# EAGLE design test-board-64 (EAGLE 8.3.2)
DESIGNER: JON NEWMAN, MWL@MIT; DESIGN_NAME: 64 Channel Headstage Test Board; LICENSE: (c) Jon Newman CERN OHL v1.2; REVISION: 1.3
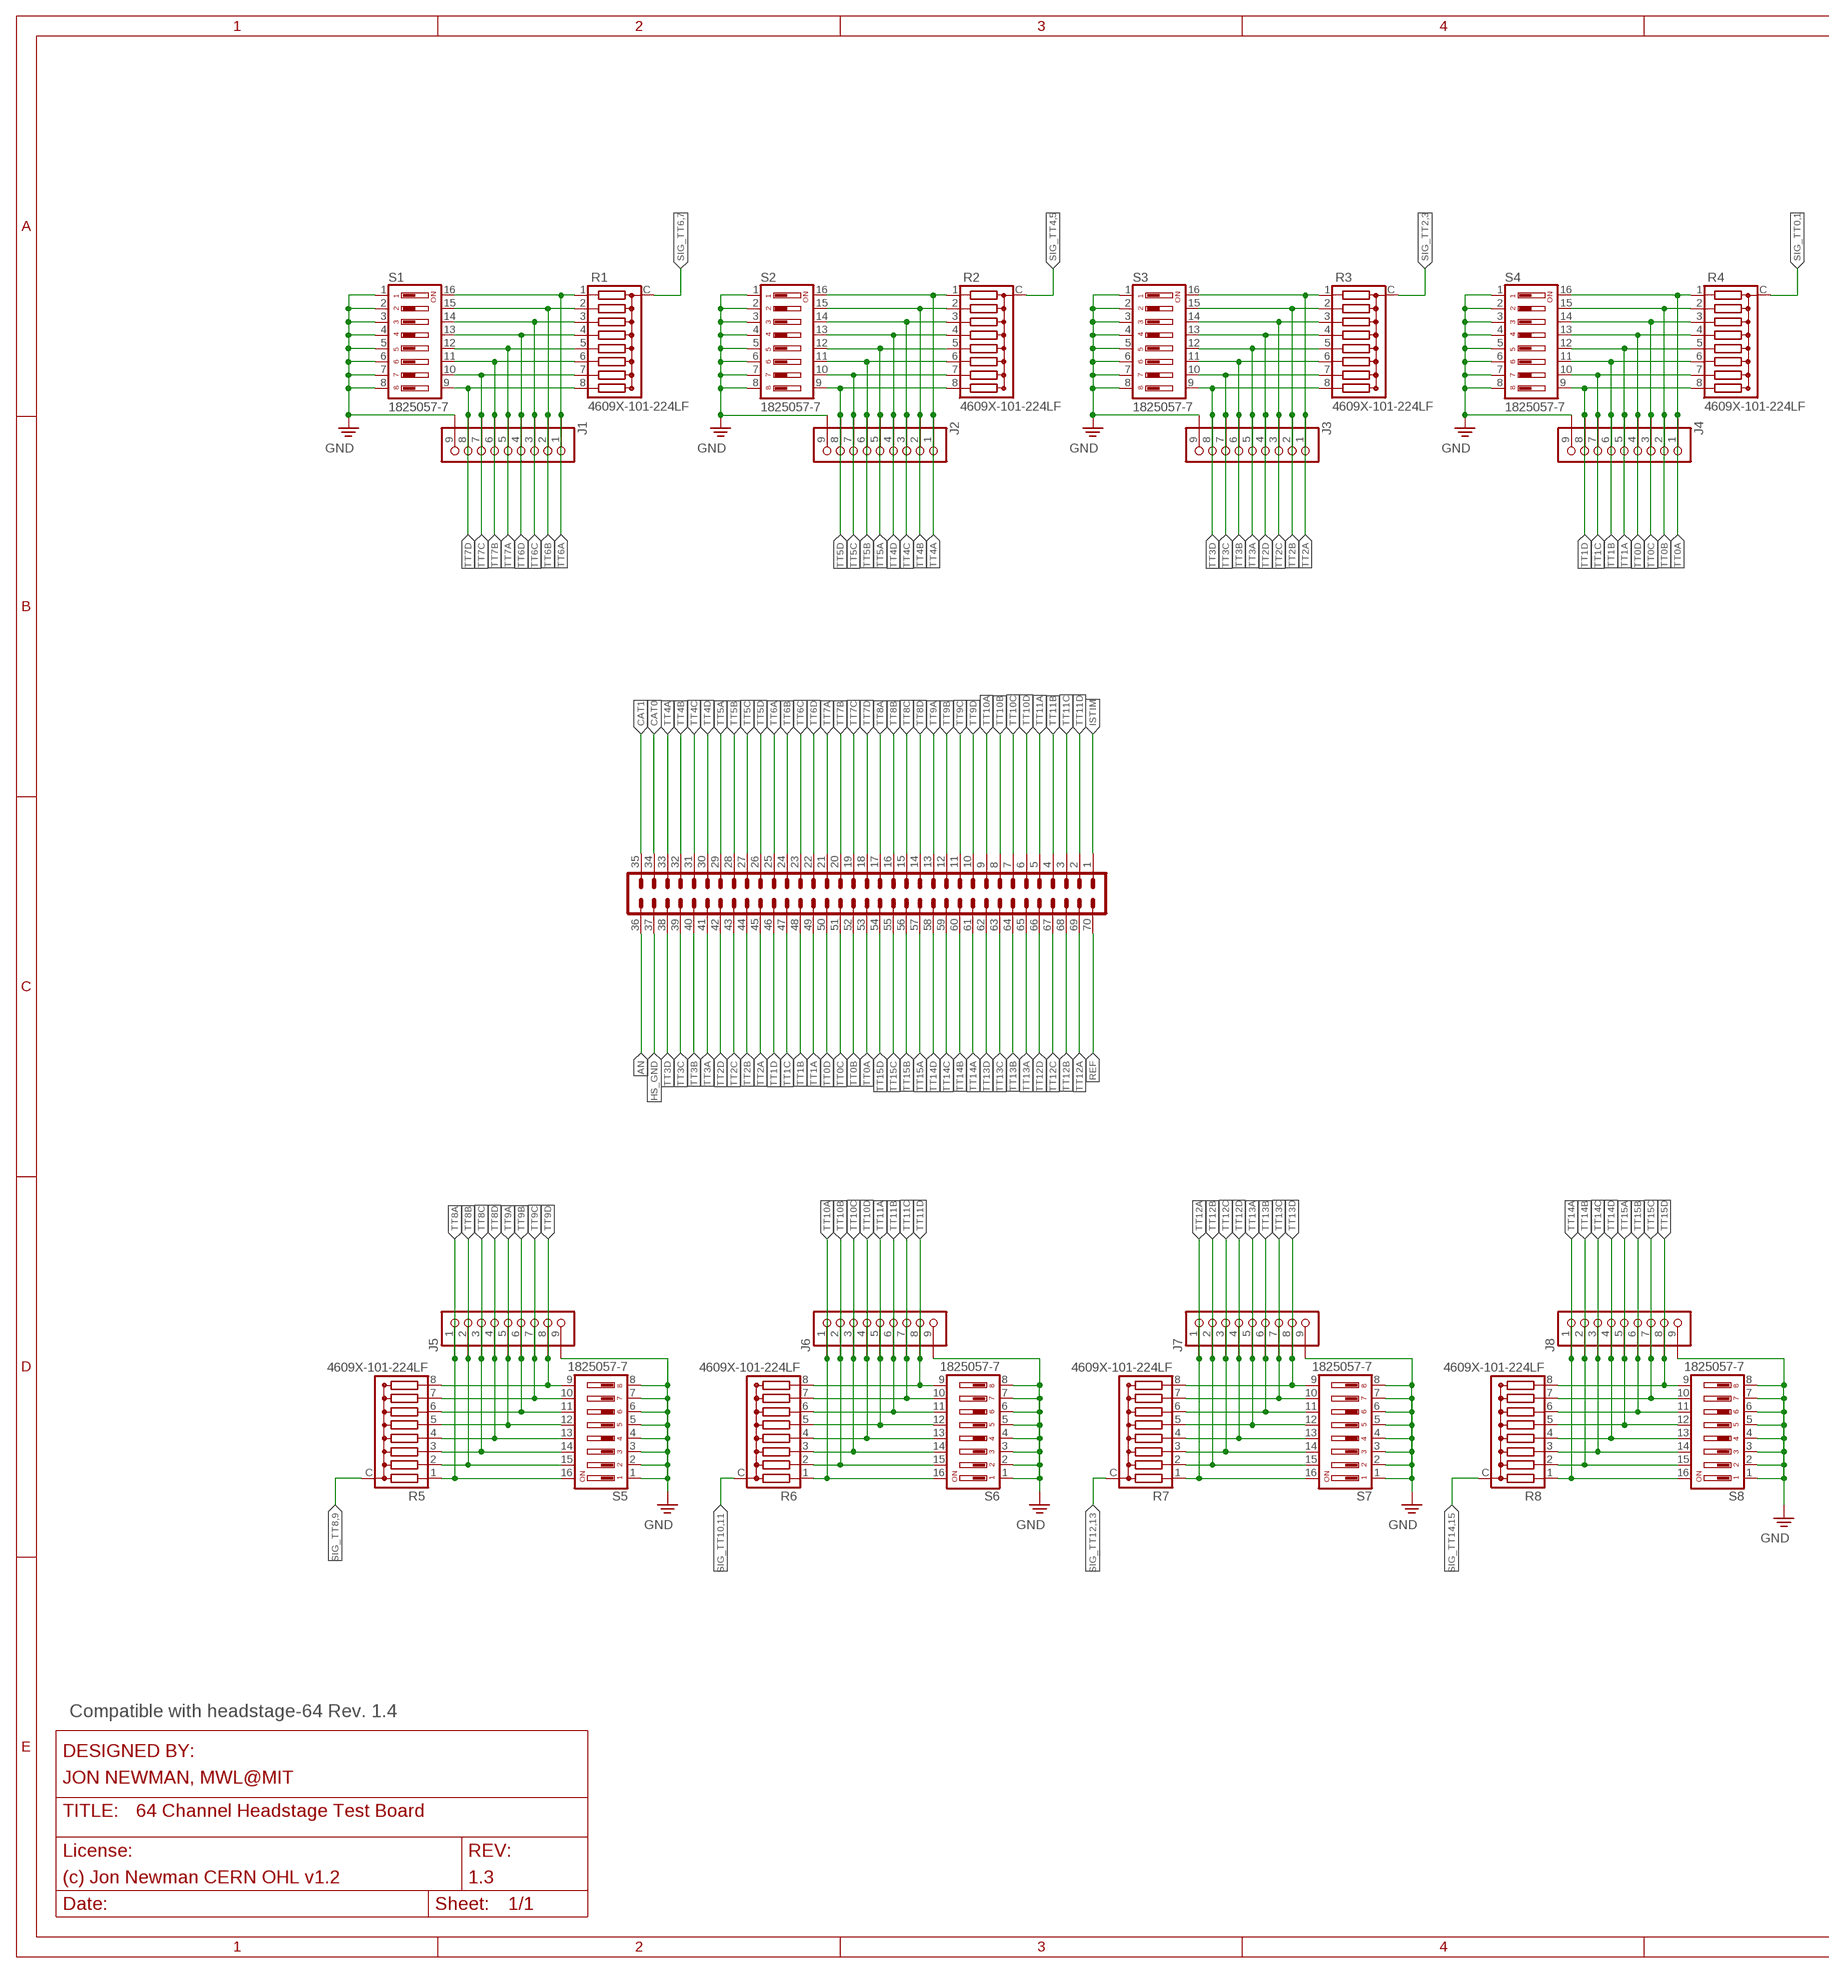
[diagram p0: schematic, sheet 1, part 1 of 2]
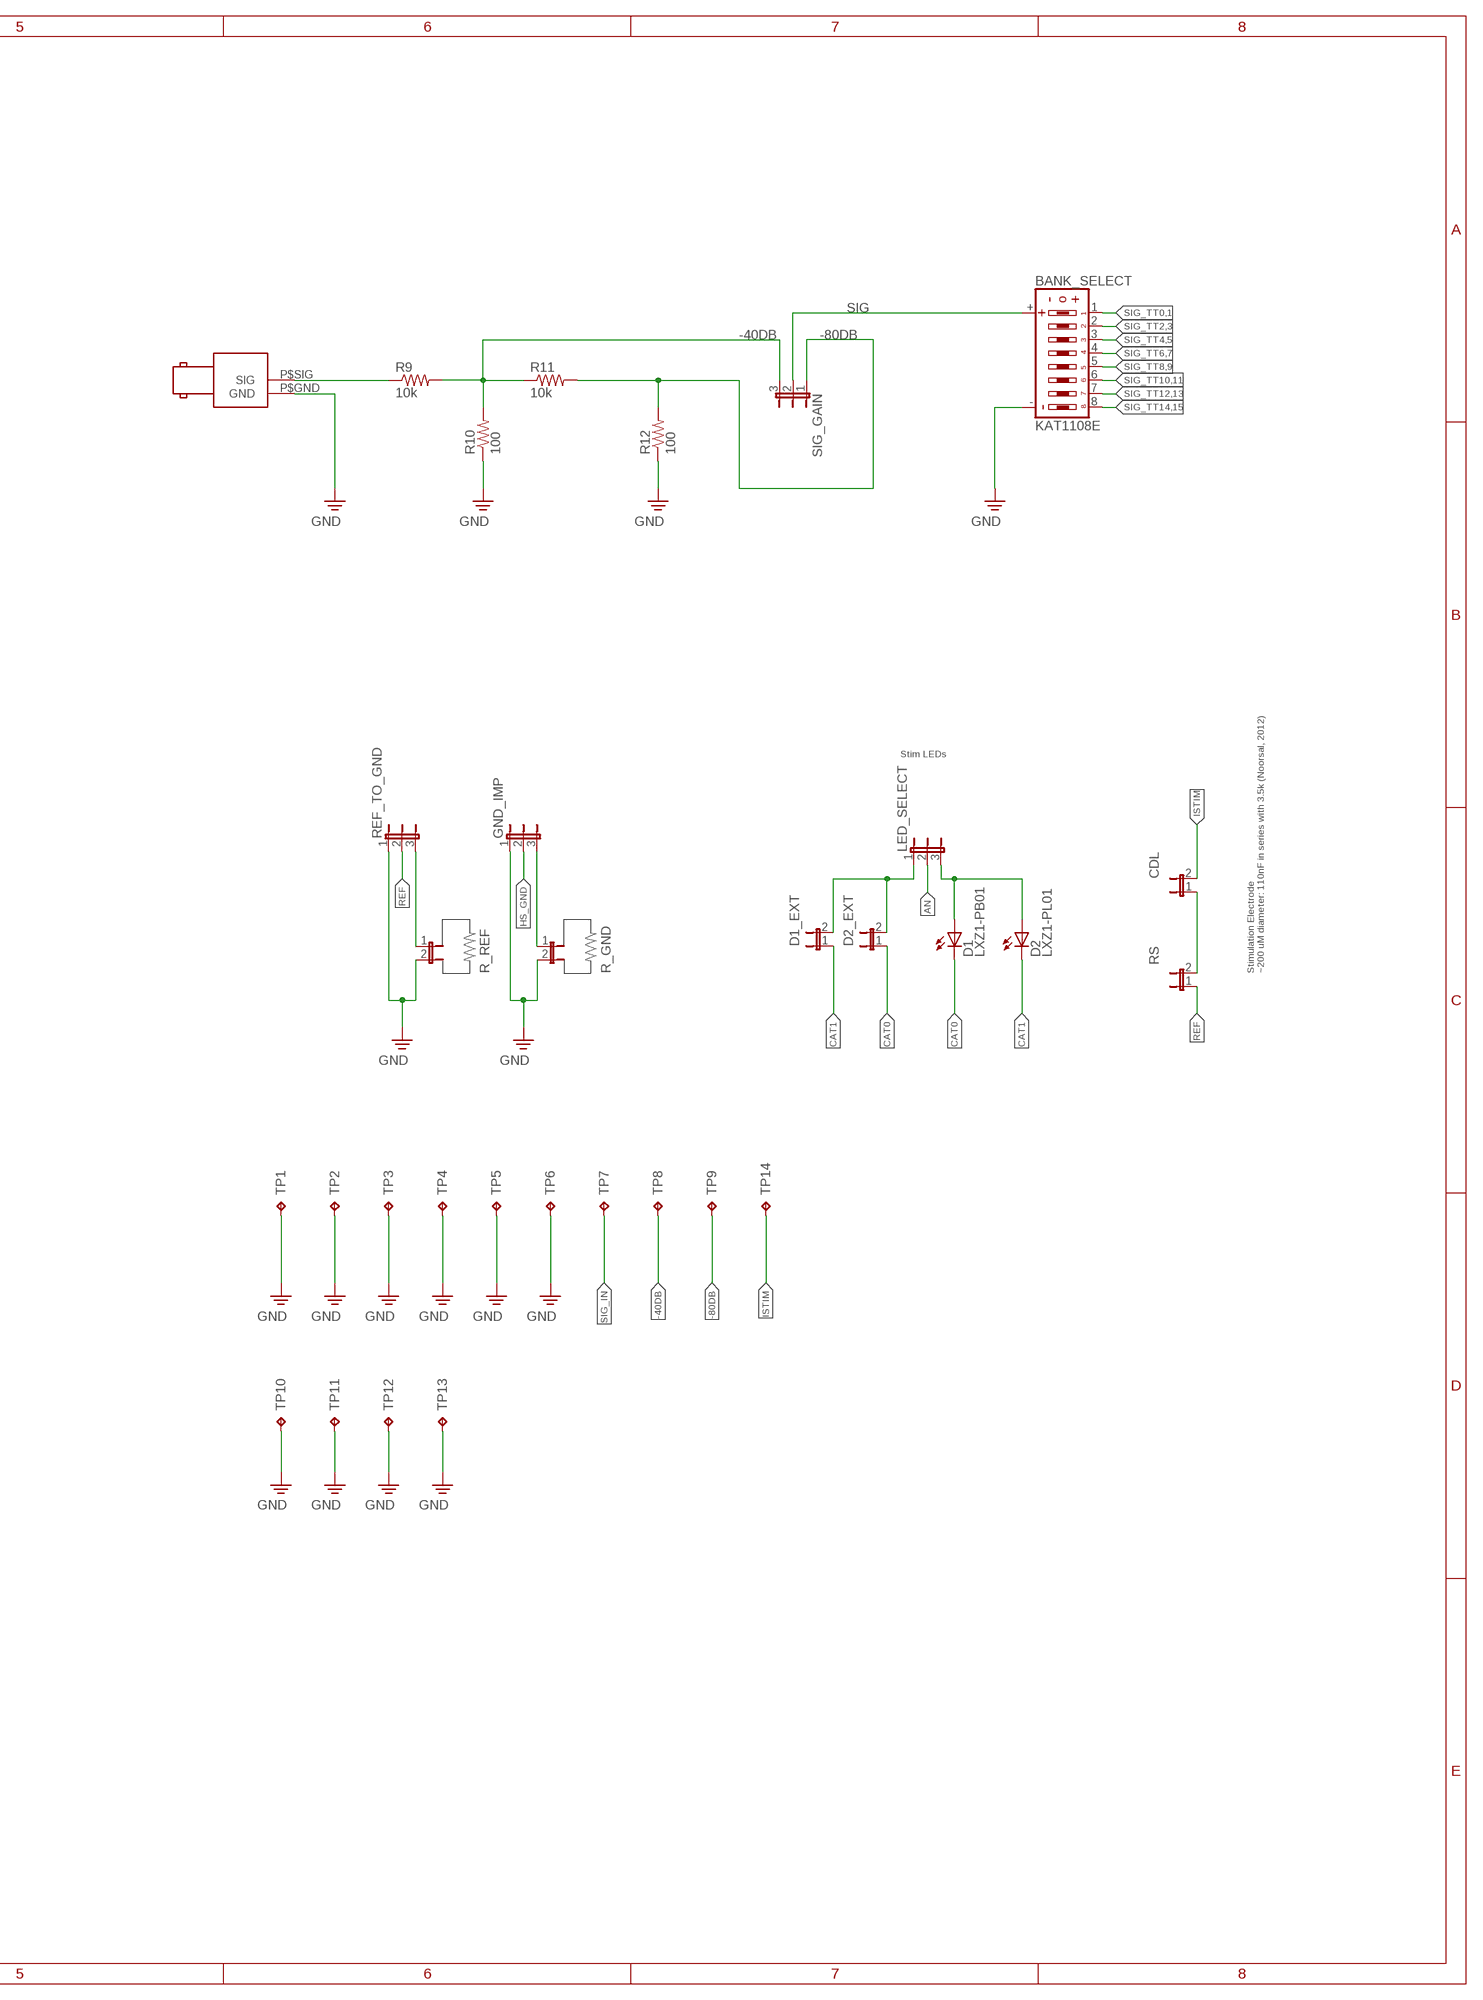
[diagram p1: schematic, sheet 1, part 2 of 2]

## Parts
BANK_SELECT  KAT1108E  DIPSW-008-SPDT_206-124  [206-124_DIP8-SPDT]
CDL  SOC2-0.1"  JP2E_THRU-HOLE  [JP2]
D1  LXZ1-PB01  LED_LXZ1  [LXZ1]
D1_EXT  SOC2-0.1"  JP2E_THRU-HOLE  [JP2]
D2  LXZ1-PL01  LED_LXZ1  [LXZ1]
D2_EXT  SOC2-0.1"  JP2E_THRU-HOLE  [JP2]
GND_IMP  JP3-0.1"  JP3E  [JP3]
HEADSTAGE  DF40C-70DP-0.4V(51)  PINHD-2X35_DF40REF-LRG  [DDF40-70REC-LRG]
J1  PINHD-1X9  [1X09]
J2  PINHD-1X9  [1X09]
J3  PINHD-1X9  [1X09]
J4  PINHD-1X9  [1X09]
J5  PINHD-1X9  [1X09]
J6  PINHD-1X9  [1X09]
J7  PINHD-1X9  [1X09]
J8  PINHD-1X9  [1X09]
LED_SELECT  JP3-0.1"  JP3E  [JP3]
R1  4609X-101-224LF  RN1X8  [RNX8-0.1]
R2  4609X-101-224LF  RN1X8  [RNX8-0.1]
R3  4609X-101-224LF  RN1X8  [RNX8-0.1]
R4  4609X-101-224LF  RN1X8  [RNX8-0.1]
R5  4609X-101-224LF  RN1X8  [RNX8-0.1]
R6  4609X-101-224LF  RN1X8  [RNX8-0.1]
R7  4609X-101-224LF  RN1X8  [RNX8-0.1]
R8  4609X-101-224LF  RN1X8  [RNX8-0.1]
R9  10k  R_0805  [0805]
R10  100  R_0805  [0805]
R11  10k  R_0805  [0805]
R12  100  R_0805  [0805]
R_GND  SOC2-0.1"  JP2E_THRU-HOLE  [JP2]
R_REF  SOC2-0.1"  JP2E_THRU-HOLE  [JP2]
REF_TO_GND  JP3-0.1"  JP3E  [JP3]
RS  SOC2-0.1"  JP2E_THRU-HOLE  [JP2]
S1  1825057-7  DIPSW-008_ADE  [ADE_DIP8-SPST]
S2  1825057-7  DIPSW-008_ADE  [ADE_DIP8-SPST]
S3  1825057-7  DIPSW-008_ADE  [ADE_DIP8-SPST]
S4  1825057-7  DIPSW-008_ADE  [ADE_DIP8-SPST]
S5  1825057-7  DIPSW-008_ADE  [ADE_DIP8-SPST]
S6  1825057-7  DIPSW-008_ADE  [ADE_DIP8-SPST]
S7  1825057-7  DIPSW-008_ADE  [ADE_DIP8-SPST]
S8  1825057-7  DIPSW-008_ADE  [ADE_DIP8-SPST]
SIG_GAIN  JP3-0.1"  JP3E  [JP3]
SIG_IN  1-1634622-0  BNC_RIGHT_ANGLE  [BNC_RIGHT_ANGLE]
TP1  GND  TPPAD1-20  [P1-20]
TP2  GND  TPPAD1-20  [P1-20]
TP3  GND  TPPAD1-20  [P1-20]
TP4  GND  TPPAD1-20  [P1-20]
TP5  GND  TPPAD1-20  [P1-20]
TP6  GND  TPPAD1-20  [P1-20]
TP7  SIG_IN  TPPAD1-20  [P1-20]
TP8  -40dB  TPPAD1-20  [P1-20]
TP9  -80dB  TPPAD1-20  [P1-20]
TP10  TP_4-40  [4-40_PLATED]
TP11  TP_4-40  [4-40_PLATED]
TP12  TP_4-40  [4-40_PLATED]
TP13  TP_4-40  [4-40_PLATED]
TP14  V_ESTIM  TPPAD1-20  [P1-20]

## Nets
-40DB: R9.2 R10.2 R11.1 SIG_GAIN.3 TP8.TP
-80DB: R11.2 R12.2 SIG_GAIN.1 TP9.TP
AN: HEADSTAGE.36 LED_SELECT.2
AN_INT: D1.A D2.A LED_SELECT.3
CAT0: D1.C D2_EXT.1 HEADSTAGE.34
CAT1: D1_EXT.1 D2.C HEADSTAGE.35
GND: BANK_SELECT.- GND_IMP.1 J1.9 J2.9 J3.9 J4.9 J5.9 J6.9 J7.9 J8.9 R10.1 R12.1 R_GND.2 R_REF.2 REF_TO_GND.1 S1.1 S1.2 S1.3 S1.4 S1.5 S1.6 S1.7 S1.8 S2.1 S2.2 S2.3 S2.4 S2.5 S2.6 S2.7 S2.8 S3.1 S3.2 S3.3 S3.4 S3.5 S3.6 S3.7 S3.8 S4.1 S4.2 S4.3 S4.4 S4.5 S4.6 S4.7 S4.8 S5.1 S5.2 S5.3 S5.4 S5.5 S5.6 S5.7 S5.8 S6.1 S6.2 S6.3 S6.4 S6.5 S6.6 S6.7 S6.8 S7.1 S7.2 S7.3 S7.4 S7.5 S7.6 S7.7 S7.8 S8.1 S8.2 S8.3 S8.4 S8.5 S8.6 S8.7 S8.8 SIG_IN.P$GND(GND) TP1.TP TP2.TP TP3.TP TP4.TP TP5.TP TP6.TP TP10.P$1(TP) TP11.P$1(TP) TP12.P$1(TP) TP13.P$1(TP)
HS_GND: GND_IMP.2 HEADSTAGE.37
ISTIM: CDL.2 HEADSTAGE.1 TP14.TP
N$1: D1_EXT.2 D2_EXT.2 LED_SELECT.1
N$2: GND_IMP.3 R_GND.1
N$3: CDL.1 RS.2
N$15: R_REF.1 REF_TO_GND.3
REF: HEADSTAGE.70 REF_TO_GND.2 RS.1
SIG: BANK_SELECT.+ SIG_GAIN.2
SIG_IN: R9.1 SIG_IN.P$SIG(SIG) TP7.TP
SIG_TT0,1: BANK_SELECT.1 R4.C
SIG_TT2,3: BANK_SELECT.2 R3.C
SIG_TT4,5: BANK_SELECT.3 R2.C
SIG_TT6,7: BANK_SELECT.4 R1.C
SIG_TT8,9: BANK_SELECT.5 R5.C
SIG_TT10,11: BANK_SELECT.6 R6.C
SIG_TT12,13: BANK_SELECT.7 R7.C
SIG_TT14,15: BANK_SELECT.8 R8.C
TT0A: HEADSTAGE.53 J4.1 R4.1 S4.16
TT0B: HEADSTAGE.52 J4.2 R4.2 S4.15
TT0C: HEADSTAGE.51 J4.3 R4.3 S4.14
TT0D: HEADSTAGE.50 J4.4 R4.4 S4.13
TT1A: HEADSTAGE.49 J4.5 R4.5 S4.12
TT1B: HEADSTAGE.48 J4.6 R4.6 S4.11
TT1C: HEADSTAGE.47 J4.7 R4.7 S4.10
TT1D: HEADSTAGE.46 J4.8 R4.8 S4.9
TT2A: HEADSTAGE.45 J3.1 R3.1 S3.16
TT2B: HEADSTAGE.44 J3.2 R3.2 S3.15
TT2C: HEADSTAGE.43 J3.3 R3.3 S3.14
TT2D: HEADSTAGE.42 J3.4 R3.4 S3.13
TT3A: HEADSTAGE.41 J3.5 R3.5 S3.12
TT3B: HEADSTAGE.40 J3.6 R3.6 S3.11
TT3C: HEADSTAGE.39 J3.7 R3.7 S3.10
TT3D: HEADSTAGE.38 J3.8 R3.8 S3.9
TT4A: HEADSTAGE.33 J2.1 R2.1 S2.16
TT4B: HEADSTAGE.32 J2.2 R2.2 S2.15
TT4C: HEADSTAGE.31 J2.3 R2.3 S2.14
TT4D: HEADSTAGE.30 J2.4 R2.4 S2.13
TT5A: HEADSTAGE.29 J2.5 R2.5 S2.12
TT5B: HEADSTAGE.28 J2.6 R2.6 S2.11
TT5C: HEADSTAGE.27 J2.7 R2.7 S2.10
TT5D: HEADSTAGE.26 J2.8 R2.8 S2.9
TT6A: HEADSTAGE.25 J1.1 R1.1 S1.16
TT6B: HEADSTAGE.24 J1.2 R1.2 S1.15
TT6C: HEADSTAGE.23 J1.3 R1.3 S1.14
TT6D: HEADSTAGE.22 J1.4 R1.4 S1.13
TT7A: HEADSTAGE.21 J1.5 R1.5 S1.12
TT7B: HEADSTAGE.20 J1.6 R1.6 S1.11
TT7C: HEADSTAGE.19 J1.7 R1.7 S1.10
TT7D: HEADSTAGE.18 J1.8 R1.8 S1.9
TT8A: HEADSTAGE.17 J5.1 R5.1 S5.16
TT8B: HEADSTAGE.16 J5.2 R5.2 S5.15
TT8C: HEADSTAGE.15 J5.3 R5.3 S5.14
TT8D: HEADSTAGE.14 J5.4 R5.4 S5.13
TT9A: HEADSTAGE.13 J5.5 R5.5 S5.12
TT9B: HEADSTAGE.12 J5.6 R5.6 S5.11
TT9C: HEADSTAGE.11 J5.7 R5.7 S5.10
TT9D: HEADSTAGE.10 J5.8 R5.8 S5.9
TT10A: HEADSTAGE.9 J6.1 R6.1 S6.16
TT10B: HEADSTAGE.8 J6.2 R6.2 S6.15
TT10C: HEADSTAGE.7 J6.3 R6.3 S6.14
TT10D: HEADSTAGE.6 J6.4 R6.4 S6.13
TT11A: HEADSTAGE.5 J6.5 R6.5 S6.12
TT11B: HEADSTAGE.4 J6.6 R6.6 S6.11
TT11C: HEADSTAGE.3 J6.7 R6.7 S6.10
TT11D: HEADSTAGE.2 J6.8 R6.8 S6.9
TT12A: HEADSTAGE.69 J7.1 R7.1 S7.16
TT12B: HEADSTAGE.68 J7.2 R7.2 S7.15
TT12C: HEADSTAGE.67 J7.3 R7.3 S7.14
TT12D: HEADSTAGE.66 J7.4 R7.4 S7.13
TT13A: HEADSTAGE.65 J7.5 R7.5 S7.12
TT13B: HEADSTAGE.64 J7.6 R7.6 S7.11
TT13C: HEADSTAGE.63 J7.7 R7.7 S7.10
TT13D: HEADSTAGE.62 J7.8 R7.8 S7.9
TT14A: HEADSTAGE.61 J8.1 R8.1 S8.16
TT14B: HEADSTAGE.60 J8.2 R8.2 S8.15
TT14C: HEADSTAGE.59 J8.3 R8.3 S8.14
TT14D: HEADSTAGE.58 J8.4 R8.4 S8.13
TT15A: HEADSTAGE.57 J8.5 R8.5 S8.12
TT15B: HEADSTAGE.56 J8.6 R8.6 S8.11
TT15C: HEADSTAGE.55 J8.7 R8.7 S8.10
TT15D: HEADSTAGE.54 J8.8 R8.8 S8.9

## Notes on the sheet
- Stim LEDs
- Stimulation Electrode
  ~200 uM diameter: 110nF in series with 3.5k (Noorsal, 2012)
- Compatible with headstage-64 Rev. 1.4

## Library data of the parts
BANK_SELECT = jonnew:DIPSW-008-SPDT
CDL D1_EXT D2_EXT R_GND R_REF RS = jonnew:JP2E
D1 D2 = jonnew:LED: Surface mount LED
GND_IMP LED_SELECT REF_TO_GND SIG_GAIN = jonnew:JP3E
HEADSTAGE = jonnew:PINHD-2X35
J1-J8 = test-board:PINHD-1X9
R1-R8 = jonnew:RN1X8
R9-R12 = jonnew:R: Resistor
S1-S8 = jonnew:DIPSW-008
SIG_IN = josh:BNC_RIGHT_ANGLE
TP1-TP14 = jonnew:TP: Test pad

## Net classes
1 thick: width 0.102 mm

## Board
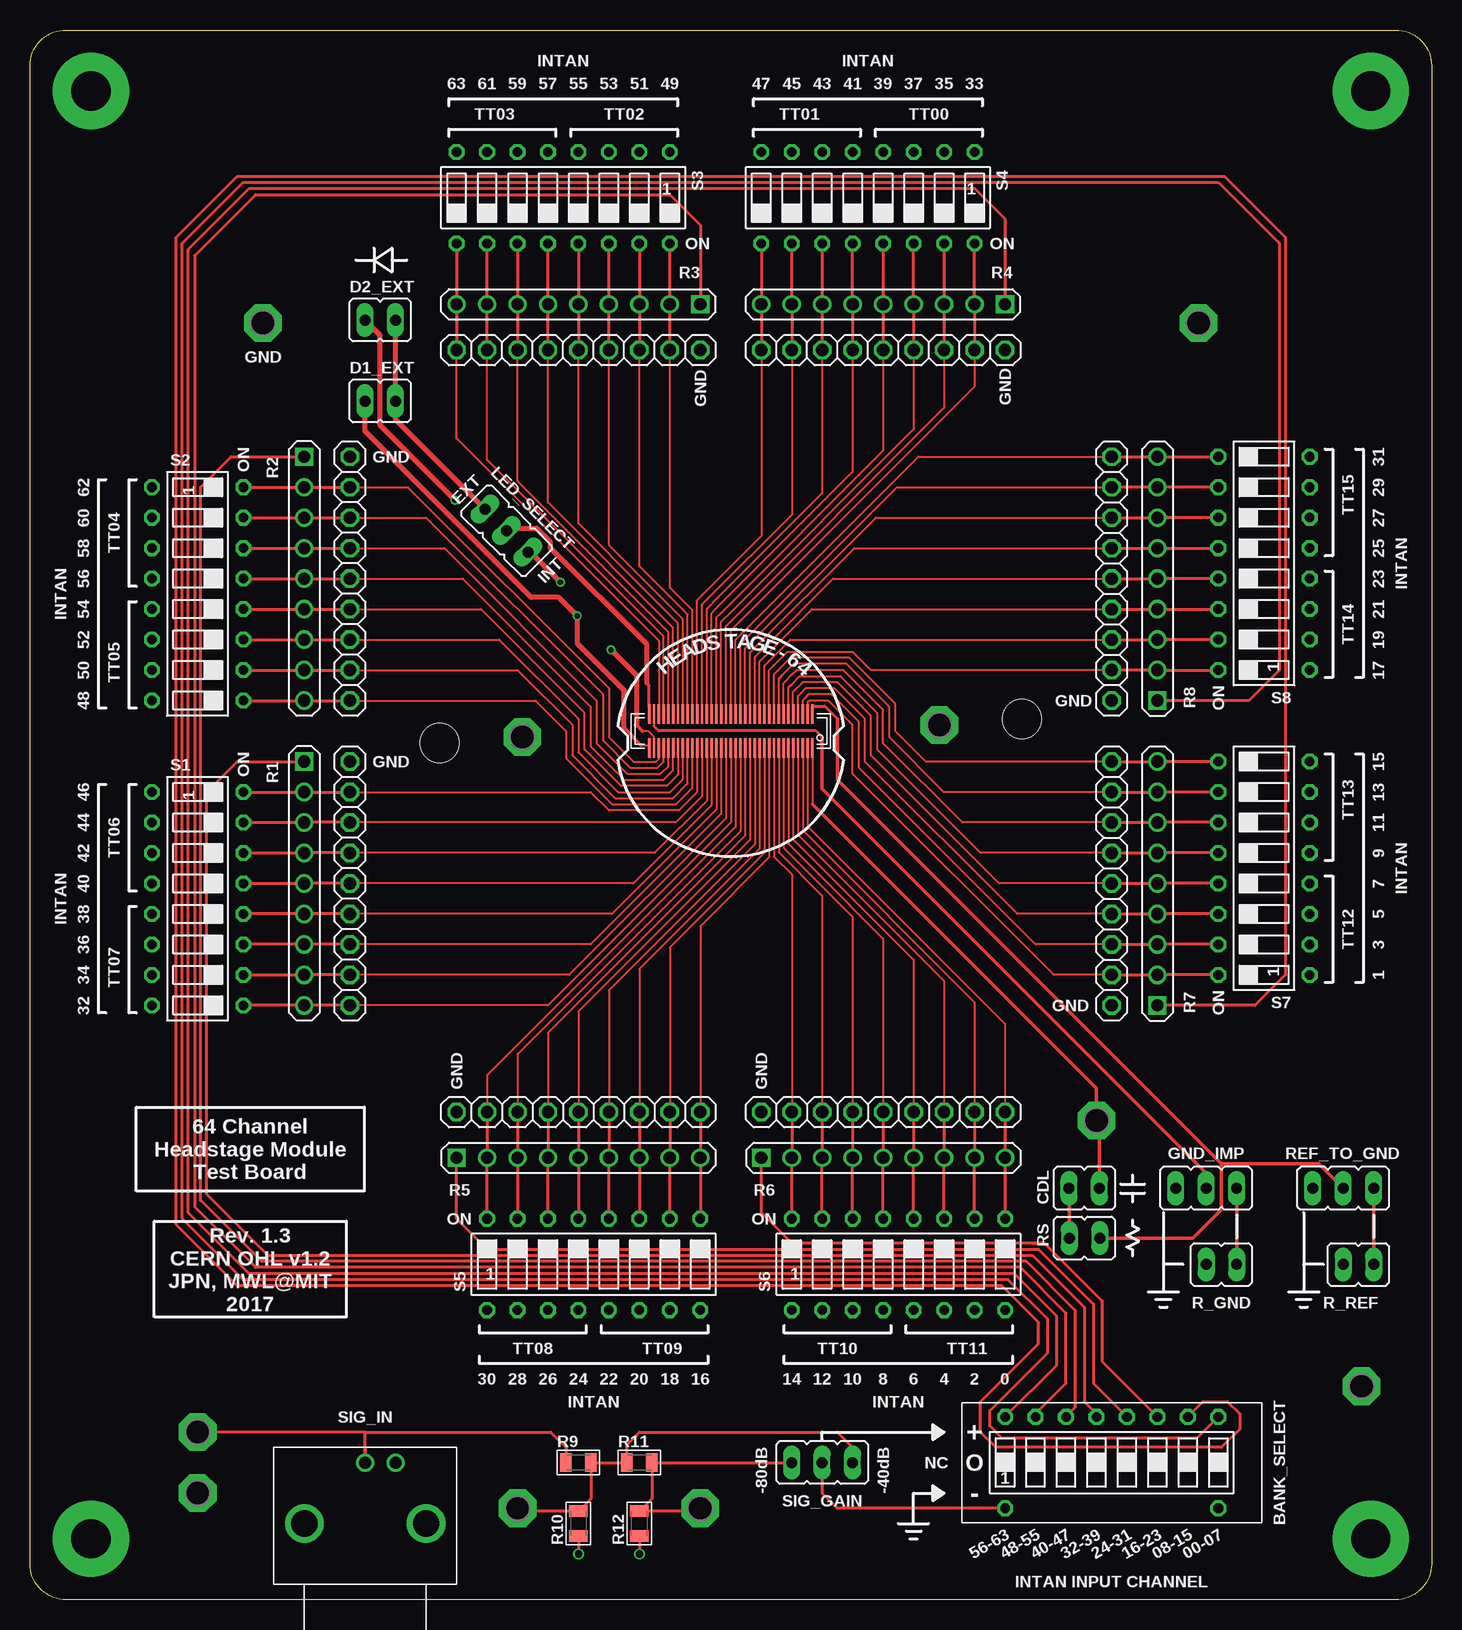
[diagram p2: board, top side]
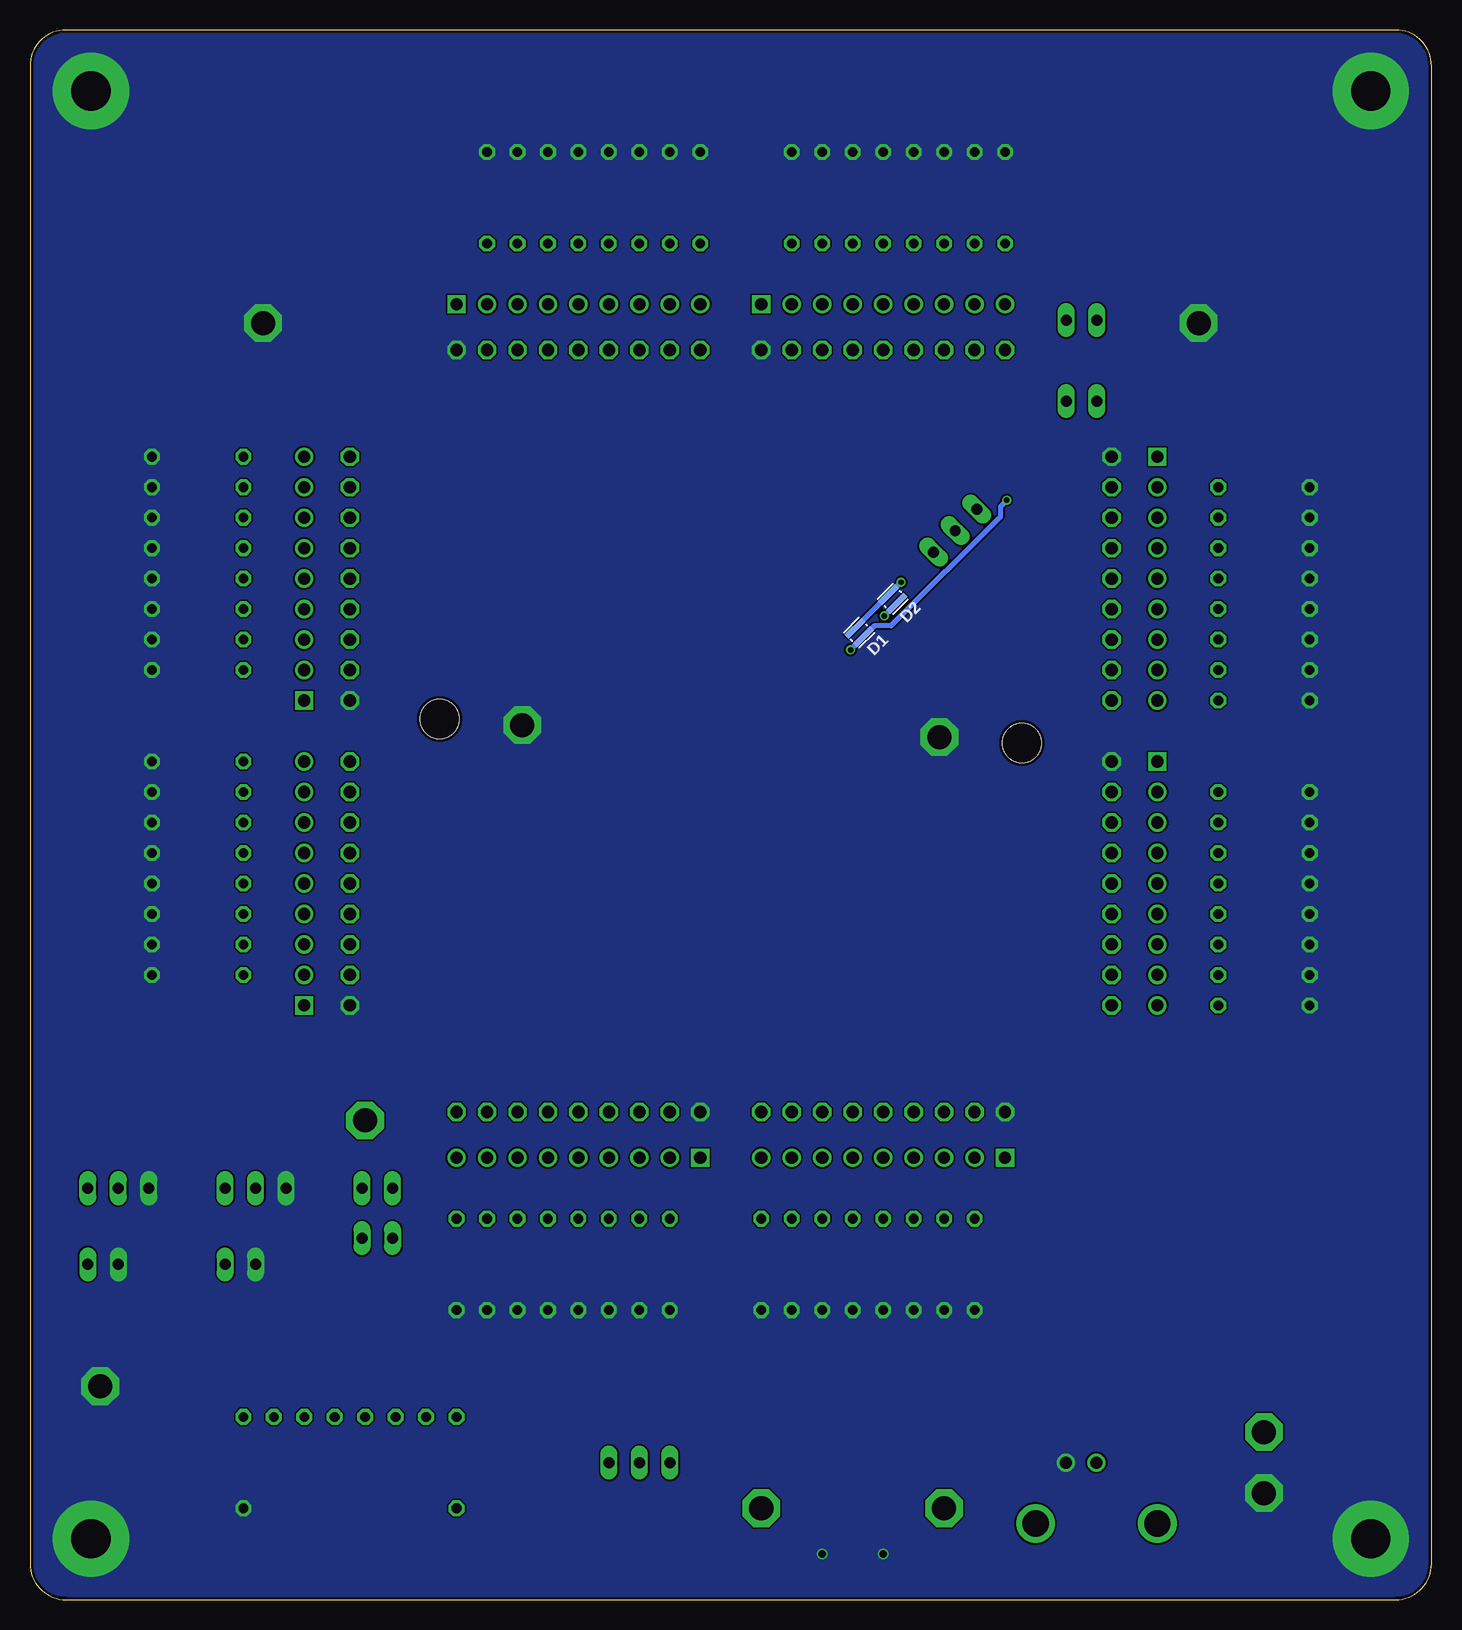
[diagram p3: board, bottom side, seen from below]

Size 116.84 x 130.81 mm. Coordinates in mm from the lower left corner, seen from the top.
Outline: 116.84,127.81 116.84,3 arc-90 113.84,0 3,0 arc-90 0,3 0,127.81 arc-90 3,130.81 113.84,130.81 arc-90 116.84,127.81
Copper layers (1*16): Top 0.035mm / dielectric 1.5mm / Bottom 0.035mm
Design rules "seeed-studio-2-layer *": minimum track width 6mil, minimum drill 12mil, track to track 6mil, track to pad 6mil, pad to pad 6mil, via to via 6mil, smd to smd 0mil, copper to edge 10mil, drill to drill 10mil, minimum pad ring 10mil, minimum via ring 6mil, stop-mask expansion 2mil, vias tented up to drill 100mil, thermal gap 10mil
Holes 3.26 mm at 34.15,71.39 82.69,73.39

### Footprints (pad centres in the part's own frame; a part is rotated, then mirrored left to right if it is on the bottom)
206-124_DIP8-SPDT = drill 0.8 octagon: 1 -8.89,3.81; 2 -6.35,3.81; 3 -3.81,3.81; 4 -1.27,3.81; 5 1.27,3.81; 6 3.81,3.81; 7 6.35,3.81; 8 8.89,3.81; + -8.89,-3.81; - 8.89,-3.81
JP2 = drill 0.914 long: 1 0,0; 2 2.54,0
LXZ1 = smd 0.45 x 2: A 0.5,0; C -0.5,0
JP3 = drill 0.914 long: 1 0,0; 2 2.54,0; 3 5.08,0
DDF40-70REC-LRG = smd 0.2 x 1.64: 1 -6.8,1.42; 2 -6.4,1.42; 3 -6,1.42; 4 -5.6,1.42; 5 -5.2,1.42; 6 -4.8,1.42; 7 -4.4,1.42; 8 -4,1.42; 9 -3.6,1.42; 10 -3.2,1.42; 11 -2.8,1.42; 12 -2.4,1.42; 13 -2,1.42; 14 -1.6,1.42; 15 -1.2,1.42; 16 -0.8,1.42; 17 -0.4,1.42; 18 0,1.42; 19 0.4,1.42; 20 0.8,1.42; 21 1.2,1.42; 22 1.6,1.42; 23 2,1.42; 24 2.4,1.42; 25 2.8,1.42; 26 3.2,1.42; 27 3.6,1.42; 28 4,1.42; 29 4.4,1.42; 30 4.8,1.42; 31 5.2,1.42; 32 5.6,1.42; 33 6,1.42; 34 6.4,1.42; 35 6.8,1.42; 36 6.8,-1.42; 37 6.4,-1.42; 38 6,-1.42; 39 5.6,-1.42; 40 5.2,-1.42; 41 4.8,-1.42; 42 4.4,-1.42; 43 4,-1.42; 44 3.6,-1.42; 45 3.2,-1.42; 46 2.8,-1.42; 47 2.4,-1.42; 48 2,-1.42; 49 1.6,-1.42; 50 1.2,-1.42; 51 0.8,-1.42; 52 0.4,-1.42; 53 0,-1.42; 54 -0.4,-1.42; 55 -0.8,-1.42; 56 -1.2,-1.42; 57 -1.6,-1.42; 58 -2,-1.42; 59 -2.4,-1.42; 60 -2.8,-1.42; 61 -3.2,-1.42; 62 -3.6,-1.42; 63 -4,-1.42; 64 -4.4,-1.42; 65 -4.8,-1.42; 66 -5.2,-1.42; 67 -5.6,-1.42; 68 -6,-1.42; 69 -6.4,-1.42; 70 -6.8,-1.42
1X09 = drill 1.016 octagon: 1 0,0; 2 2.54,0; 3 5.08,0; 4 7.62,0; 5 10.16,0; 6 12.7,0; 7 15.24,0; 8 17.78,0; 9 -2.54,0
RNX8-0.1 = drill 1.016: 1 2.54,0; 2 5.08,0; 3 7.62,0; 4 10.16,0; 5 12.7,0; 6 15.24,0; 7 17.78,0; 8 20.32,0 | drill 1.016 square: C 0,0
0805 = smd 0.965 x 1.524: 1 -1.041,0; 2 1.041,0
ADE_DIP8-SPST = drill 0.8 octagon: 1 -8.89,-3.81; 2 -6.35,-3.81; 3 -3.81,-3.81; 4 -1.27,-3.81; 5 1.27,-3.81; 6 3.81,-3.81; 7 6.35,-3.81; 8 8.89,-3.81; 9 8.89,3.81; 10 6.35,3.81; 11 3.81,3.81; 12 1.27,3.81; 13 -1.27,3.81; 14 -3.81,3.81; 15 -6.35,3.81; 16 -8.89,3.81
BNC_RIGHT_ANGLE = drill 2.2: P$1 0,0; P$2 10.16,0 | drill 1: P$GND 2.54,-5.08; P$SIG 5.08,-5.08
P1-20 = drill 2.007 pad 3.15 octagon: TP 0,0
4-40_PLATED = drill 3.264 pad 6.35: P$1 0,0

### Placement (x,y rotation side)
BANK_SELECT  90.17,11.43 0 top
CDL  86.61,34.29 0 top
D1  47.72,80.59 135 bottom
D1_EXT  27.92,99.89 0 top
D2  44.92,83.39 135 bottom
D2_EXT  27.92,106.64 0 top
GND_IMP  95.5,34.29 0 top
HEADSTAGE  58.42,72.39 180 top
J1  26.67,67.31 270 top
J2  26.67,92.71 270 top
J3  53.34,104.14 180 top
J4  78.74,104.14 180 top
J5  38.1,40.64 0 top
J6  63.5,40.64 0 top
J7  90.17,52.07 90 top
J8  90.17,77.47 90 top
LED_SELECT  37.92,90.89 315 top
R1  22.86,69.85 270 top
R2  22.86,95.25 270 top
R3  55.88,107.95 180 top
R4  81.28,107.95 180 top
R5  35.56,36.83 0 top
R6  60.96,36.83 0 top
R7  93.98,49.53 90 top
R8  93.98,74.93 90 top
R9  45.72,11.43 0 top
R10  45.72,6.35 90 top
R11  50.8,11.43 0 top
R12  50.8,6.35 90 top
R_GND  100.58,27.94 180 top
R_REF  112.01,27.94 180 top
REF_TO_GND  106.93,34.29 0 top
RS  89.17,30.14 180 top
S1  13.97,58.42 270 top
S2  13.97,83.82 270 top
S3  44.45,116.84 180 top
S4  69.85,116.84 180 top
S5  46.99,27.94 0 top
S6  72.39,27.94 0 top
S7  102.87,60.96 90 top
S8  102.87,86.36 90 top
SIG_GAIN  63.5,11.43 0 top
SIG_IN  33.02,6.35 180 top
TP1  13.97,8.89 0 top
TP2  111,17.78 0 top
TP3  19.42,106.39 0 top
TP4  97.42,106.39 0 top
TP5  41.04,71.89 0 top
TP6  75.8,72.89 0 top
TP7  13.97,13.97 0 top
TP8  40.64,7.62 0 top
TP9  55.88,7.62 0 top
TP10  5.08,5.08 0 top
TP11  111.76,5.08 0 top
TP12  5.08,125.73 0 top
TP13  111.76,125.73 0 top
TP14  88.91,39.94 0 top

### Tracks (layer width: path | path; a pad name or v marks a point on that pad's centre or on a via)
-40DB
  Top 0.254: 68.58,12.7 67.31,13.97 50.8,13.97 49.76,12.93 R11.1 R9.2 46.76,8.43 R10.2 40.87,7.39
  Top 0.305: 68.58,12.7 SIG_GAIN.3 | 40.87,7.39 TP8.TP
-80DB
  Top 0.254: SIG_GAIN.1 R11.2 51.84,8.43 R12.2 55.65,7.39
  Top 0.305: TP9.TP 55.65,7.39
AN
  Top 0.178: HEADSTAGE.36 51.62,74.39
  Top 0.254: 51.42,76.39 51.62,76.19 51.62,74.39
  Top 0.406: 51.42,76.39 51.42,79.61 43.4,87.64 43.4,88.11 42.22,89.29 39.91,89.29 LED_SELECT.2
AN_INT  (via drill 0.45)
  Top 0.406: v44.22,84.79 41.71,87.3 LED_SELECT.3
  Bottom 0.406: 48.02,80.99 D2.A v44.23,84.79 v44.22,84.79 | D1.A 48.02,80.99 | 48.02,80.99
CAT0  (via drill 0.45)
  Top 0.178: HEADSTAGE.34 52.02,71.93 51.56,72.39 51.05,72.39
  Top 0.305: 51.05,72.39 50.55,72.9
  Top 0.406: v35.42,91.64 29.17,97.89 29.17,105.39 D2_EXT.1 | 50.55,72.9 50.55,77.06 v48.45,79.16 v48.44,79.16
  Bottom 0.406: v35.42,91.64 35.92,91.14 35.92,90.29 45.05,81.16 46.45,81.16 D1.C | D1.C | v48.44,79.16 D1.C | D1.C | D1.C
CAT1  (via drill 0.45)
  Top 0.178: 50.95,71.22 51.62,71.22 HEADSTAGE.35
  Top 0.305: 49.53,72.64 50.95,71.22
  Top 0.406: D1_EXT.1 27.92,97.39 41.77,83.54 44.07,83.54 v45.61,81.99 v45.62,81.99 45.62,79.69 49.53,75.78 49.53,72.64
  Bottom 0.406: 44.07,83.54 D2.C v45.61,81.99 v45.62,81.99
GND  (via drill 0.6)
  Top 0.254: R10.1 v45.72,3.81 | R12.1 v50.8,3.81
  pour Bottom (no thermals): -43.18,-29.21 -43.18,173.99 160.02,173.99 160.02,-29.21
HS_GND
  Top 0.178: HEADSTAGE.37 52.02,72.79
  Top 0.254: 66.04,71.88 65.53,72.4 52.41,72.4 52.32,72.49 52.22,72.59 52.02,72.79
  Top 0.305: 66.04,71.88 66.04,67.56 98.04,35.56 GND_IMP.2
ISTIM
  Top 0.178: HEADSTAGE.1 65.22,66.29
  Top 0.305: 65.22,66.29 88.91,42.6 TP14.TP 89.15,39.7 CDL.2
N$1
  Top 0.254: 30.46,98.85 D1_EXT.2
  Top 0.406: LED_SELECT.1 30.46,98.35 D1_EXT.2 D2_EXT.2
N$2
  Top 0.305: GND_IMP.3 R_GND.1
N$3
  Top 0.305: CDL.1 86.63,34.27 RS.2
N$15
  Top 0.305: REF_TO_GND.3 R_REF.1
REF
  Top 0.254: 67.31,73.41 66.26,74.46 65.42,74.46 65.22,74.26 HEADSTAGE.70
  Top 0.305: 99.31,36.32 67.31,68.33 67.31,73.41 | 99.31,36.32 99.31,32.51 96.94,30.14 RS.1 | REF_TO_GND.2 107.44,36.32 99.31,36.32
SIG
  Top 0.254: SIG_GAIN.2 66.04,8.89 67.06,7.87 | 67.06,7.87 67.31,7.62 | BANK_SELECT.+ 67.31,7.62 | 67.31,7.62 67.06,7.87
SIG_IN
  Top 0.254: 27.94,13.97 43.41,13.97 44.68,12.7 R9.1 | SIG_IN.P$SIG 27.94,13.97 | 27.94,13.97 TP7.TP
  Top 0.305: SIG_IN.P$SIG 27.94,12.7
SIG_TT0,1
  Top 0.254: R4.C 81.28,115.06 78.74,117.6 18.29,117.6 13.21,112.52 13.21,32.26 18.29,27.18 82.04,27.18 85.6,23.62 85.6,19.56 BANK_SELECT.1
SIG_TT2,3
  Top 0.254: BANK_SELECT.2 83.82,15.49 86.36,18.03 86.36,23.88 82.55,27.69 18.8,27.69 13.72,32.77 13.72,112.01 18.8,117.09 53.34,117.09 55.88,114.55 R3.C
SIG_TT4,5
  Top 0.254: R2.C 16.76,95.25 14.22,92.71 14.22,33.27 19.3,28.19 83.06,28.19 87.12,24.13 87.12,16 BANK_SELECT.3
SIG_TT6,7
  Top 0.254: BANK_SELECT.4 88.9,15.49 87.88,16.51 87.88,24.38 83.57,28.7 19.81,28.7 14.73,33.78 14.73,67.31 17.27,69.85 R1.C
SIG_TT8,9
  Top 0.254: BANK_SELECT.5 88.65,18.03 88.65,24.64 84.07,29.21 38.1,29.21 35.56,31.75 R5.C
SIG_TT10,11
  Top 0.254: 83.57,29.72 63.5,29.72 60.96,32.26 R6.C | 83.57,29.72 84.58,29.72 | BANK_SELECT.6 89.41,19.81 89.41,24.89 84.58,29.72 | 84.58,29.72 83.57,29.72
SIG_TT12,13
  Top 0.254: R7.C 102.11,49.53 104.65,52.07 104.65,113.54 99.57,118.62 17.27,118.62 12.19,113.54 12.19,31.24 17.27,26.16 81.03,26.16 84.07,23.11 84.07,21.34 79.25,16.51 79.25,13.97 80.52,12.7 99.31,12.7 100.84,14.22 100.84,15.49 99.82,16.51 97.79,16.51 BANK_SELECT.7
SIG_TT14,15
  Top 0.254: BANK_SELECT.8 97.28,13.46 81.03,13.46 80.01,14.48 80.01,15.75 84.84,20.57 84.84,23.37 81.53,26.67 17.78,26.67 12.7,31.75 12.7,113.03 17.78,118.11 99.06,118.11 104.14,113.03 104.14,77.47 101.6,74.93 R8.C
TT0A
  Top 0.178: 59.23,81.58 58.42,80.77 | HEADSTAGE.53 58.42,80.77 | 58.42,80.77 59.23,81.58 | J4.1 78.74,101.09 59.23,81.58
  Top 0.254: J4.1 R4.1 S4.16
TT0B
  Top 0.178: 58.35,81.46 58.02,81.13 | HEADSTAGE.52 58.02,81.13 | 58.02,81.13 58.35,81.46 | J4.2 76.2,99.31 58.35,81.46
  Top 0.254: S4.15 R4.2 J4.2
TT0C
  Top 0.178: 58.47,82.34 57.62,81.5 | HEADSTAGE.51 57.62,81.5 | 57.62,81.5 58.47,82.34 | J4.3 73.66,97.54 58.47,82.34
  Top 0.254: J4.3 R4.3 S4.14
TT0D
  Top 0.178: 57.59,82.22 57.22,81.86 | HEADSTAGE.50 57.22,81.86 | 57.22,81.86 57.59,82.22 | J4.4 71.12,95.76 57.59,82.22
  Top 0.254: S4.13 R4.4 J4.4
TT1A
  Top 0.178: 57.2,82.61 56.82,82.22 | HEADSTAGE.49 56.82,82.22 | 56.82,82.22 57.2,82.61 | J4.5 68.58,93.98 57.2,82.61
  Top 0.254: J4.5 R4.5 S4.12
TT1B
  Top 0.178: 57.32,83.49 56.42,82.58 | HEADSTAGE.48 56.42,82.58 | 56.42,82.58 57.32,83.49 | J4.6 66.04,92.2 57.32,83.49
  Top 0.254: S4.11 R4.6 J4.6
TT1C
  Top 0.178: 56.44,83.37 56.02,82.94 | HEADSTAGE.47 56.02,82.94 | 56.02,82.94 56.44,83.37 | J4.7 63.5,90.42 56.44,83.37
  Top 0.254: J4.7 R4.7 S4.10
TT1D
  Top 0.178: 56.06,83.75 55.62,83.31 | HEADSTAGE.46 55.62,83.31 | 55.62,83.31 56.06,83.75 | J4.8 60.96,88.65 56.06,83.75
  Top 0.254: S4.9 R4.8 J4.8
TT2A
  Top 0.178: J3.1 53.34,84.33 55.22,82.45 HEADSTAGE.45
  Top 0.254: J3.1 R3.1 S3.16
TT2B
  Top 0.178: J3.2 50.8,86.11 54.47,82.44 | 54.47,82.44 54.82,82.09 | HEADSTAGE.44 54.82,82.09 | 54.82,82.09 54.47,82.44
  Top 0.254: S3.15 R3.2 J3.2
TT2C
  Top 0.178: J3.3 48.26,87.88 54.42,81.72 HEADSTAGE.43
  Top 0.254: J3.3 R3.3 S3.14
TT2D
  Top 0.178: 51.08,84.33 54.02,81.39 HEADSTAGE.42 | 51.08,84.33 51.05,84.33 | 51.08,84.33 45.72,89.69 J3.4
  Top 0.254: S3.13 R3.4 J3.4
TT3A
  Top 0.178: J3.5 43.18,91.44 53.62,81 HEADSTAGE.41
  Top 0.254: J3.5 R3.5 S3.12
TT3B
  Top 0.178: J3.6 40.64,93.22 53.22,80.64 HEADSTAGE.40
  Top 0.254: S3.11 R3.6 J3.6
TT3C
  Top 0.178: J3.7 38.1,95 52.56,80.53 | 52.56,80.53 52.82,80.28 | HEADSTAGE.39 52.82,80.28 | 52.82,80.28 52.56,80.53
  Top 0.254: J3.7 R3.7 S3.10
TT3D
  Top 0.178: J3.8 35.56,96.77 52.42,79.91 HEADSTAGE.38
  Top 0.254: S3.9 R3.8 J3.8
TT4A
  Top 0.178: J2.1 31.5,92.71 48.26,75.95 48.26,71.88 50.29,69.85 52.18,69.85 52.42,70.09 HEADSTAGE.33
  Top 0.254: J2.1 R2.1 S2.16
TT4B
  Top 0.178: J2.2 33.02,90.17 47.75,75.44 47.75,71.63 50.04,69.34 52.32,69.34 52.82,69.84 HEADSTAGE.32
  Top 0.254: J2.2 R2.2 S2.15
TT4C
  Top 0.178: J2.3 34.54,87.63 47.24,74.93 47.24,71.37 49.78,68.83 52.58,68.83 53.22,69.48 HEADSTAGE.31
  Top 0.254: J2.3 R2.3 S2.14
TT4D
  Top 0.178: J2.4 36.07,85.09 46.74,74.42 46.74,71.12 49.53,68.33 52.83,68.33 53.62,69.11 HEADSTAGE.30
  Top 0.254: J2.4 R2.4 S2.13
TT5A
  Top 0.178: J2.5 37.59,82.55 46.23,73.91 46.23,70.87 49.28,67.82 53.09,67.82 54.02,68.75 HEADSTAGE.29
  Top 0.254: J2.5 R2.5 S2.12
TT5B
  Top 0.178: J2.6 39.12,80.01 45.72,73.41 45.72,70.61 49.02,67.31 53.34,67.31 54.42,68.39 HEADSTAGE.28
  Top 0.254: J2.6 R2.6 S2.11
TT5C
  Top 0.178: J2.7 40.64,77.47 45.21,72.9 45.21,70.36 48.77,66.8 53.59,66.8 54.82,68.03 HEADSTAGE.27
  Top 0.254: J2.7 R2.7 S2.10
TT5D
  Top 0.178: J2.8 42.16,74.93 44.7,72.39 44.7,70.1 48.51,66.29 53.85,66.29 55.22,67.67 HEADSTAGE.26
  Top 0.254: S2.9 R2.8 J2.8
TT6A
  Top 0.178: J1.1 46.74,67.31 48.26,65.79 54.1,65.79 55.62,67.3 HEADSTAGE.25
  Top 0.254: J1.1 R1.1 S1.16
TT6B
  Top 0.178: HEADSTAGE.24 56.02,66.94 53.85,64.77 J1.2
  Top 0.254: S1.15 R1.2 J1.2
TT6C
  Top 0.178: HEADSTAGE.23 56.42,66.58 52.07,62.23 26.16,62.23
  Top 0.254: J1.3 26.16,62.23 R1.3 S1.14
TT6D
  Top 0.178: HEADSTAGE.22 56.82,66.22 50.29,59.69 26.42,59.69
  Top 0.254: S1.13 R1.4 26.42,59.69 J1.4
TT7A
  Top 0.178: HEADSTAGE.21 57.22,65.86 48.51,57.15 26.42,57.15
  Top 0.254: J1.5 26.42,57.15 R1.5 S1.12
TT7B
  Top 0.178: HEADSTAGE.20 57.62,65.49 46.74,54.61 J1.6
  Top 0.254: J1.6 R1.6 S1.11
TT7C
  Top 0.178: HEADSTAGE.19 58.02,65.13 44.96,52.07 J1.7
  Top 0.254: S1.10 R1.7 J1.7
TT7D
  Top 0.178: HEADSTAGE.18 58.42,64.77 43.18,49.53 26.42,49.53
  Top 0.254: J1.8 26.42,49.53 R1.8 S1.9
TT8A
  Top 0.178: HEADSTAGE.17 58.82,64.41 38.1,43.69 38.1,40.39
  Top 0.254: S5.16 R5.1 38.1,40.39 J5.1
TT8B
  Top 0.178: HEADSTAGE.16 59.22,64.05 40.64,45.47 40.64,40.13
  Top 0.254: J5.2 40.64,40.13 R5.2 S5.15
TT8C
  Top 0.178: HEADSTAGE.15 59.62,63.68 43.18,47.24 43.18,40.39
  Top 0.254: S5.14 R5.3 43.18,40.39 J5.3
TT8D
  Top 0.178: HEADSTAGE.14 60.02,63.32 45.72,49.02 J5.4
  Top 0.254: J5.4 R5.4 S5.13
TT9A
  Top 0.178: HEADSTAGE.13 60.42,62.96 48.26,50.8 J5.5
  Top 0.254: S5.12 R5.5 J5.5
TT9B
  Top 0.178: HEADSTAGE.12 60.82,62.6 50.8,52.58 J5.6
  Top 0.254: J5.6 R5.6 S5.11
TT9C
  Top 0.178: HEADSTAGE.11 61.22,62.24 53.34,54.36 53.34,40.39
  Top 0.254: S5.10 R5.7 53.34,40.39 J5.7
TT9D
  Top 0.178: HEADSTAGE.10 61.62,61.87 55.88,56.13 55.88,40.39
  Top 0.254: J5.8 55.88,40.39 R5.8 S5.9
TT10A
  Top 0.178: HEADSTAGE.9 62.02,61.93 63.5,60.45 J6.1
  Top 0.254: S6.16 R6.1 J6.1
TT10B
  Top 0.178: HEADSTAGE.8 62.42,62.29 66.04,58.67 J6.2
  Top 0.254: S6.15 R6.2 J6.2
TT10C
  Top 0.178: HEADSTAGE.7 62.82,62.66 68.58,56.9 J6.3
  Top 0.254: S6.14 R6.3 J6.3
TT10D
  Top 0.178: HEADSTAGE.6 63.22,62.99 65.76,60.45 | 65.76,60.45 65.79,60.45 | 65.76,60.45 71.12,55.09 J6.4
  Top 0.254: S6.13 R6.4 J6.4
TT11A
  Top 0.178: HEADSTAGE.5 63.62,63.38 73.66,53.34 J6.5
  Top 0.254: S6.12 R6.5 J6.5
TT11B
  Top 0.178: HEADSTAGE.4 64.02,63.74 76.2,51.56 J6.6
  Top 0.254: S6.11 R6.6 J6.6
TT11C
  Top 0.178: HEADSTAGE.3 64.42,64.1 78.74,49.78 J6.7
  Top 0.254: S6.10 R6.7 J6.7
TT11D
  Top 0.178: HEADSTAGE.2 64.82,64.47 81.28,48.01 J6.8
  Top 0.254: S6.9 R6.8 J6.8
TT12A
  Top 0.178: J7.1 85.34,52.07 68.58,68.83 68.58,72.9 66.55,74.93 64.96,74.93 64.82,74.79 HEADSTAGE.69
  Top 0.254: J7.1 R7.1 S7.16
TT12B
  Top 0.178: J7.2 83.82,54.61 69.09,69.34 69.09,73.15 66.8,75.44 64.92,75.44 64.64,75.17 | 64.64,75.17 64.42,74.94 | HEADSTAGE.68 64.42,74.94 | 64.42,74.94 64.64,75.17
  Top 0.254: J7.2 R7.2 S7.15
TT12C
  Top 0.178: J7.3 82.3,57.15 69.6,69.85 69.6,73.41 67.06,75.95 64.66,75.95 64.26,75.55 | 64.26,75.55 64.02,75.3 | HEADSTAGE.67 64.02,75.3 | 64.02,75.3 64.26,75.55
  Top 0.254: J7.3 R7.3 S7.14
TT12D
  Top 0.178: J7.4 80.77,59.69 70.1,70.36 70.1,73.66 67.31,76.45 64.41,76.45 64.38,76.43 | 64.38,76.43 63.62,75.67 | HEADSTAGE.66 63.62,75.67 | 63.62,75.67 64.38,76.43
  Top 0.254: J7.4 R7.4 S7.13
TT13A
  Top 0.178: J7.5 79.25,62.23 70.61,70.87 70.61,73.91 67.56,76.96 64.15,76.96 63.5,76.31 | 63.5,76.31 63.22,76.03 | HEADSTAGE.65 63.22,76.03 | 63.22,76.03 63.5,76.31
  Top 0.254: J7.5 R7.5 S7.12
TT13B
  Top 0.178: J7.6 77.72,64.77 71.12,71.37 71.12,74.17 67.82,77.47 63.9,77.47 63.62,77.19 | 63.62,77.19 62.82,76.39 | HEADSTAGE.64 62.82,76.39 | 62.82,76.39 63.62,77.19
  Top 0.254: J7.6 R7.6 S7.11
TT13C
  Top 0.178: J7.7 76.2,67.31 71.63,71.88 71.63,74.42 68.07,77.98 63.65,77.98 62.74,77.07 | 62.74,77.07 62.42,76.75 | HEADSTAGE.63 62.42,76.75 | 62.42,76.75 62.74,77.07
  Top 0.254: J7.7 R7.7 S7.10
TT13D
  Top 0.178: J7.8 74.68,69.85 72.14,72.39 72.14,74.68 68.33,78.49 63.39,78.49 62.36,77.45 | 62.36,77.45 62.02,77.11 | HEADSTAGE.62 62.02,77.11 | 62.02,77.11 62.36,77.45
  Top 0.254: J7.8 R7.8 S7.9
TT14A
  Top 0.178: J8.1 70.1,77.47 68.58,78.99 63.14,78.99 61.98,77.83 | 61.98,77.83 61.62,77.48 | HEADSTAGE.61 61.62,77.48 | 61.62,77.48 61.98,77.83
  Top 0.254: J8.1 R8.1 S8.16
TT14B
  Top 0.178: 61.6,78.21 61.22,77.84 | 61.6,78.21 63.39,80.01 J8.2 | HEADSTAGE.60 61.22,77.84 | 61.22,77.84 61.6,78.21
  Top 0.254: J8.2 R8.2 S8.15
TT14C
  Top 0.178: 61.22,78.59 60.82,78.2 | 61.22,78.59 65.17,82.55 J8.3 | HEADSTAGE.59 60.82,78.2 | 60.82,78.2 61.22,78.59
  Top 0.254: J8.3 R8.3 S8.14
TT14D
  Top 0.178: 61.33,79.48 60.42,78.56 | 61.33,79.48 66.95,85.09 J8.4 | HEADSTAGE.58 60.42,78.56 | 60.42,78.56 61.33,79.48
  Top 0.254: J8.4 R8.4 S8.13
TT15A
  Top 0.178: 60.45,79.36 60.02,78.92 | 60.45,79.36 68.73,87.63 J8.5 | HEADSTAGE.57 60.02,78.92 | 60.02,78.92 60.45,79.36
  Top 0.254: J8.5 R8.5 S8.12
TT15B
  Top 0.178: 60.07,79.74 59.62,79.29 | 60.07,79.74 70.5,90.17 J8.6 | HEADSTAGE.56 59.62,79.29 | 59.62,79.29 60.07,79.74
  Top 0.254: J8.6 R8.6 S8.11
TT15C
  Top 0.178: 59.69,80.12 59.22,79.65 | 59.69,80.12 72.28,92.71 J8.7 | HEADSTAGE.55 59.22,79.65 | 59.22,79.65 59.69,80.12
  Top 0.254: S8.10 R8.7 J8.7
TT15D
  Top 0.178: 59.31,80.5 58.82,80.01 | 59.31,80.5 74.06,95.25 J8.8 | HEADSTAGE.54 58.82,80.01 | 58.82,80.01 59.31,80.5
  Top 0.254: J8.8 R8.8 S8.9

### Text on the board
tPlace: INTAN | INTAN | 63 | 61 | 59 | 57 | 55 | 53 | 51 | 49 | 47 | 45 | 43 | 41 | 39 | 37 | 35 | 33 | TT03 | TT02 | TT01 | TT00 | GND | GND | GND | GND | 31 | 62 | EXT | TT15 | 29 | 60 | 27 | TT04 | 58 | 25 | INTAN | 56 | INT | 23 | INTAN | 54 | 21 | TT14 | 52 | 19 | A | D | S | T | A | G | E | - | TT05 | H | E | 6 | 50 | 4 | 17 | 48 | GND | GND | 15 | 46 | 13 | TT13 | 44 | 11 | TT06 | 42 | 9 | INTAN | 40 | 7 | INTAN | 38 | 5 | TT12 | 36 | 3 | 34 | TT07 | 1 | 32 | GND | GND | GND | 64 Channel / Headstage Module / Test Board | Rev. 1.3 / CERN OHL v1.2 / JPN, MWL@MIT / 2017 | TT08 | TT09 | TT10 | TT11 | 30 | 28 | 26 | 24 | 22 | 20 | 18 | 16 | 14 | 12 | 10 | 8 | 6 | 4 | 2 | 0 | INTAN | INTAN | NC | -80dB | -40dB | 56-63 | 48-55 | 40-47 | 32-39 | 24-31 | 16-23 | 08-15 | 00-07 | INTAN INPUT CHANNEL